# EAGLE design rc (EAGLE 9.6.2)
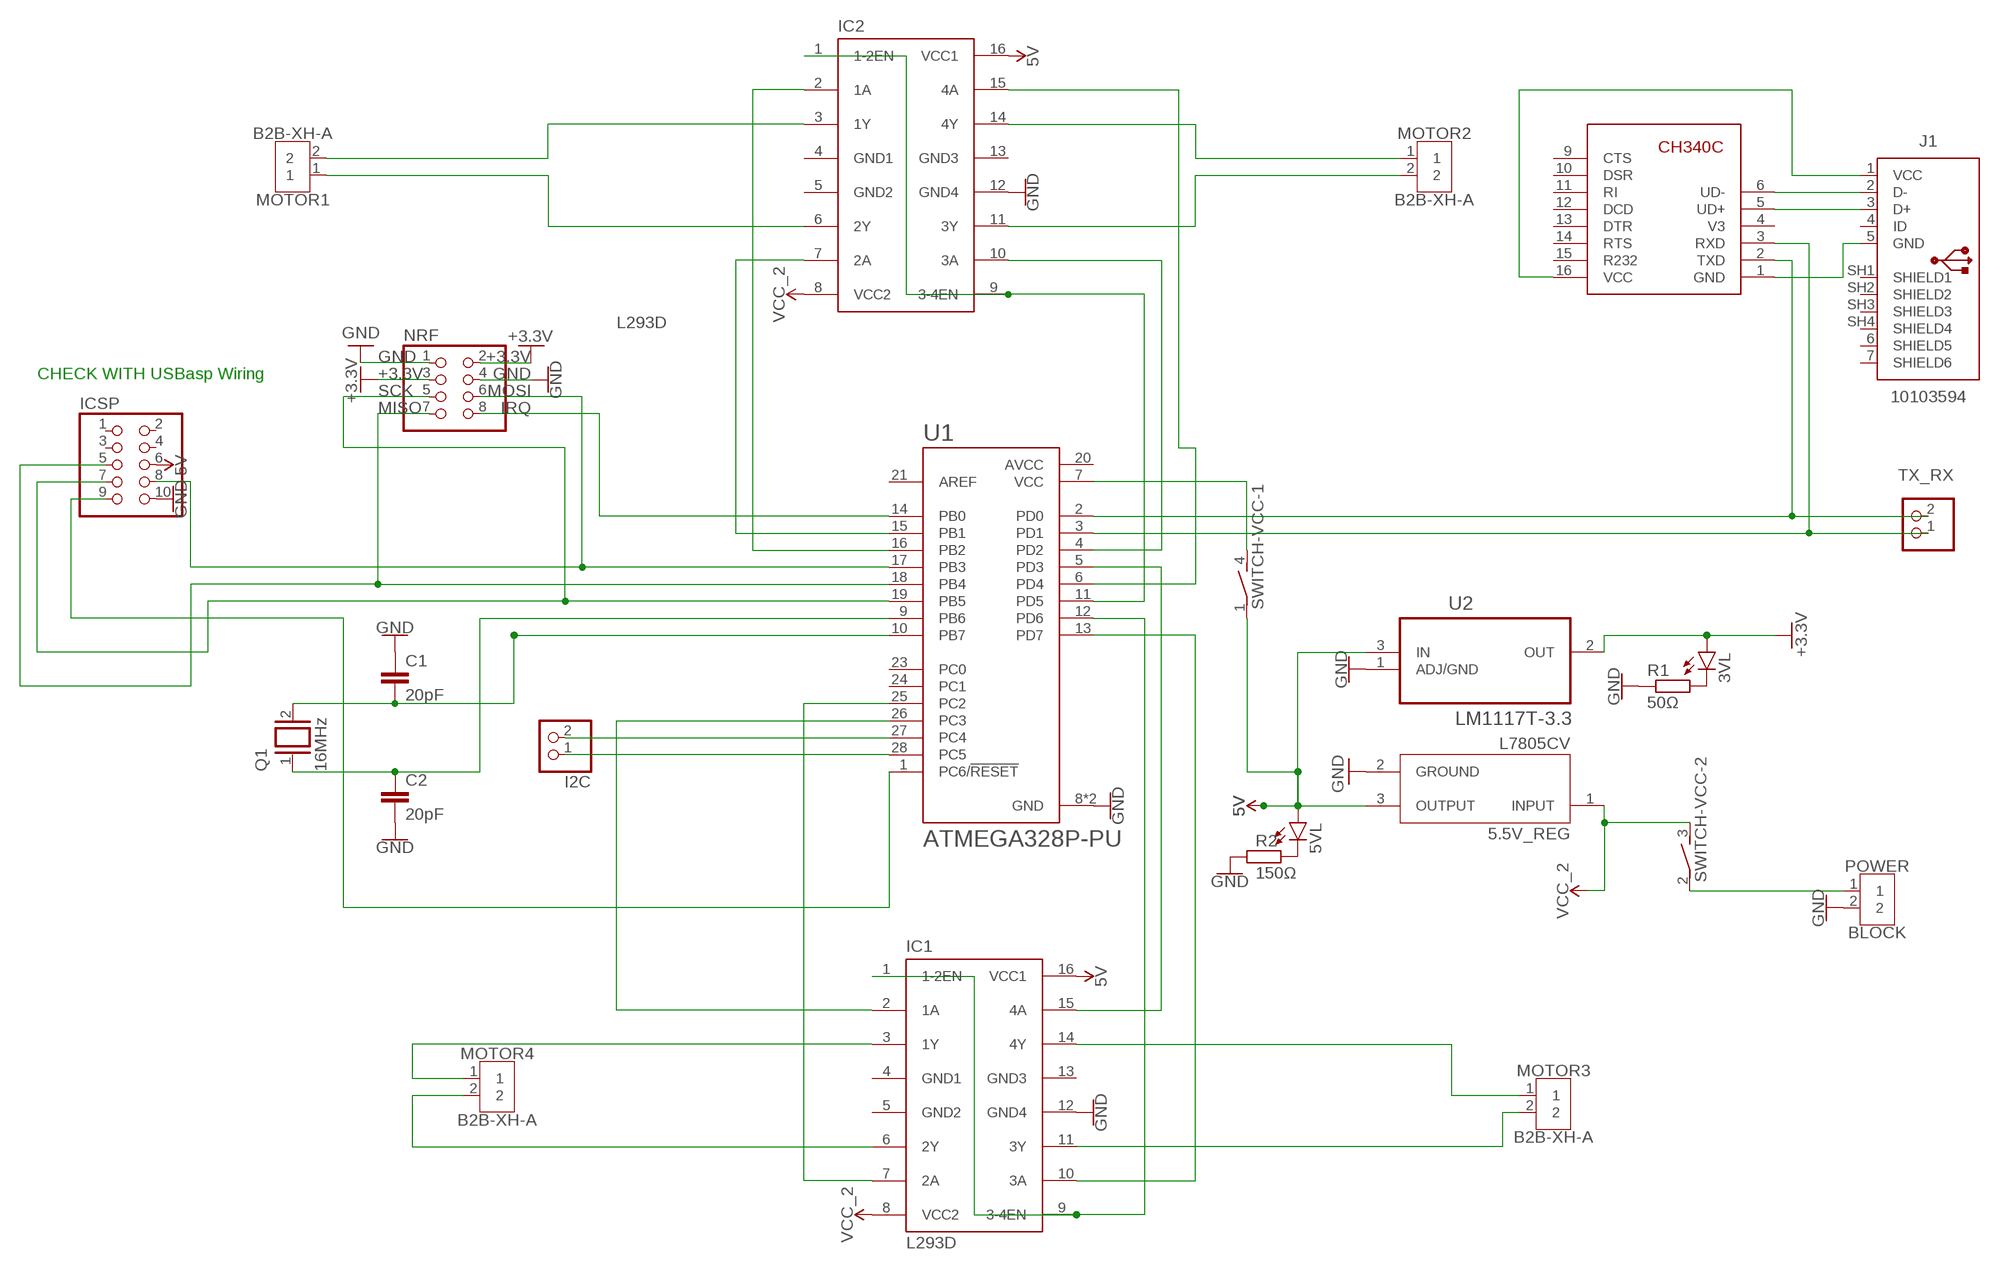
[diagram p0: schematic, sheet 1]

## Parts
3VL  LED5MM  [LED5MM]
5.5V_REG  L7805CV  [TO255P1040X460X1968-3]
5VL  LED5MM  [LED5MM]
C1  20pF  C-EU025-025X050  [C025-025X050]
C2  20pF  C-EU025-025X050  [C025-025X050]
I2C  PINHD-1X2  [1X02]
IC1  L293D  [DIL16]
IC2  L293D  [DIL16]
ICSP  PINHD-2X5  [2X05]
J1  10103594  [10103594]
MOTOR1  B2B-XH-A  [B2B-XH-A]
MOTOR2  B2B-XH-A  [B2B-XH-A]
MOTOR3  B2B-XH-A  [B2B-XH-A]
MOTOR4  B2B-XH-A  [B2B-XH-A]
NRF  PINHD-2X4  [2X04]
POWER  BLOCK  2828XX-2282834-2  [TERMBLK_254-2N]
Q1  16MHz  XTAL/S  [QS]
R1  50Ω  R-EU_0204/7  [0204/7]
R2  150Ω  R-EU_0204/7  [0204/7]
SWITCH-VCC  DS02E  [DS-02]
TX_RX  PINHD-1X2  [1X02]
U1  ATMEGA328P-PU  [DIP794W46P254L2967H457Q28B]
U2  LM1117T-3.3  [TO254P470X1016X2222-3P]
U$1  CH340C  [SOP16-1.27-10.0X5.0MM]

## Nets
5V: 5.5V_REG.3(OUTPUT) 5VL.A IC1.16(VCC1) IC2.16(VCC1) ICSP.6 SWITCH-VCC.1 U2.3(IN)
+3.3V: 3VL.A NRF.2 NRF.3 U2.2(OUT)
GND: 5.5V_REG.2(GROUND) C1.1 C2.2 IC1.12(GND4) IC2.12(GND4) ICSP.10 NRF.1 NRF.4 POWER.2 R1.1 R2.1 U1.8(GND) U1.22(GND) U2.1(ADJ/GND)
IRQ: NRF.8 U1.14(PB0)
MISO: ICSP.5 NRF.7 U1.18(PB4)
MOSI: ICSP.8 NRF.6 U1.17(PB3)
N$1: C1.2 Q1.2 U1.10(PB7)
N$2: J1.1(VCC) U$1.16(VCC)
N$3: IC1.14(4Y) MOTOR3.1
N$4: IC1.11(3Y) MOTOR3.2
N$5: IC1.3(1Y) MOTOR4.1
N$6: IC1.6(2Y) MOTOR4.2
N$7: IC2.3(1Y) MOTOR1.2
N$8: IC2.6(2Y) MOTOR1.1
N$9: IC2.14(4Y) MOTOR2.1
N$10: IC2.11(3Y) MOTOR2.2
N$11: IC2.1(1-2EN) IC2.9(3-4EN) U1.11(PD5)
N$12: IC2.15(4A) U1.6(PD4)
N$13: IC1.1(1-2EN) IC1.9(3-4EN) U1.12(PD6)
N$14: IC2.10(3A) U1.4(PD2)
N$15: IC1.10(3A) U1.13(PD7)
N$16: IC1.2(1A) U1.26(PC3)
N$17: C2.1 Q1.1 U1.9(PB6)
N$19: I2C.2 U1.27(PC4)
N$20: I2C.1 U1.28(PC5)
N$22: 5VL.K(C) R2.2
N$23: 3VL.K(C) R1.2
N$24: J1.2(D-) U$1.6(UD-)
N$26: J1.3(D+) U$1.5(UD+)
N$27: POWER.1 SWITCH-VCC.2
N$28: SWITCH-VCC.4 U1.7(VCC)
N$31: J1.5(GND) U$1.1(GND)
N$32: IC1.15(4A) U1.5(PD3)
N$33: IC1.7(2A) U1.25(PC2)
N$34: IC2.7(2A) U1.15(PB1)
N$35: IC2.2(1A) U1.16(PB2)
RESET: ICSP.9 U1.1(PC6/!RESET)
RX: TX_RX.2 U1.2(PD0) U$1.2(TXD)
SCK: ICSP.7 NRF.5 U1.19(PB5)
TX: TX_RX.1 U1.3(PD1) U$1.3(RXD)
VCC_2: 5.5V_REG.1(INPUT) IC1.8(VCC2) IC2.8(VCC2) SWITCH-VCC.3
Unconnected: ICSP.1 ICSP.2 ICSP.3 ICSP.4 J1.4(ID) J1.6(SHIELD5) J1.7(SHIELD6) J1.SH1(SHIELD1) J1.SH2(SHIELD2) J1.SH3(SHIELD3) J1.SH4(SHIELD4) U1.21(AREF) U1.23(PC0) U1.24(PC1) U$1.4(V3) U$1.9(CTS) U$1.10(DSR) U$1.11(RI) U$1.12(DCD) U$1.13(DTR) U$1.14(RTS) U$1.15(R232)

## Notes on the sheet
- CHECK WITH USBasp Wiring

## Power pins joined to a net without a drawn wire
AVCC: U1.20(AVCC)
GND1: IC1.4(GND1) IC2.4(GND1)
GND2: IC1.5(GND2) IC2.5(GND2)
GND3: IC1.13(GND3) IC2.13(GND3)

## Library data of the parts
3VL 5VL = led:LED: LED OSRAM: - CHIPLED LG R971, LG N971, LY N971, LG Q971, LY Q971, LO R971, LY R971 LH N974, LH R974 LS Q976, LO Q976, LY Q976 LO Q996 - Hyper CHIPLED LW Q18S LB Q993, LB Q99A, LB R99A - SideLED LS A670, LO A670, LY A670, LG A670, LP A670 LB A673, LV A673, LT A673, LW A673 LH A674 LY A675 LS A676, LA A676, LO A676, LY A676, LW A676 LS A679, LY A679, LG A679 - Hyper Micro SIDELED® LS Y876, LA Y876, LO Y876, LY Y876 LT Y87S - SmartLED LW L88C, LW L88S LB L89C, LB L89S, LG L890 LS L89K, LO L89K, LY L89K LS L896, LA L896, LO L896, LY L896 - TOPLED LS T670, LO T670, LY T670, LG T670, LP T670 LSG T670, LSP T670, LSY T670, LOP T670, LYG T670 LG T671, LOG T671, LSG T671 LB T673, LV T673, LT T673, LW T673 LH T674 LS T676, LA T676, LO T676, LY T676, LB T676, LH T676, LSB T676, LW T676 LB T67C, LV T67C, LT T67C, LS T67K, LO T67K, LY T67K, LW E67C LS E67B, LA E67B, LO E67B, LY E67B, LB E67C, LV E67C, LT E67C LW T67C LS T679, LY T679, LG T679 LS T770, LO T770, LY T770, LG T770, LP T770 LB T773, LV T773, LT T773, LW T773 LH T774 LS E675, LA E675, LY E675, LS T675 LS T776, LA T776, LO T776, LY T776, LB T776 LHGB T686 LT T68C, LB T68C - Hyper Mini TOPLED® LB M676 - Mini TOPLED Santana® LG M470 LS M47K, LO M47K, LY M47K Source: http://www.osram.convergy.de LUXEON: - LUMILED® LXK2-PW12-R00, LXK2-PW12-S00, LXK2-PW14-U00, LXK2-PW14-V00 LXK2-PM12-R00, LXK2-PM12-S00, LXK2-PM14-U00 LXK2-PE12-Q00, LXK2-PE12-R00, LXK2-PE12-S00, LXK2-PE14-T00, LXK2-PE14-U00 LXK2-PB12-K00, LXK2-PB12-L00, LXK2-PB12-M00, LXK2-PB14-N00, LXK2-PB14-P00, LXK2-PB14-Q00 LXK2-PR12-L00, LXK2-PR12-M00, LXK2-PR14-Q00, LXK2-PR14-R00 LXK2-PD12-Q00, LXK2-PD12-R00, LXK2-PD12-S00 LXK2-PH12-R00, LXK2-PH12-S00 LXK2-PL12-P00, LXK2-PL12-Q00, LXK2-PL12-R00 Source: www.luxeon.com KINGBRIGHT: KA-3528ASYC Source: www.kingbright.com
5.5V_REG = L7805CV:L7805CV: Standard Regulator Pos 5V 1.5A 3-Pin(3+Tab) TO-220 Standard Regulator Pos 5V 1.5A 3-Pin(3+Tab) TO-220 Check availability <https://pricing.snapeda.com/parts/L7805C-V/STMicroelectronics/view-part?ref=eda>; AVAILABILITY: In Stock; CHECK_PRICES: https://www.snapeda.com/parts/L7805C-V/STMicroelectronics/view-part/?ref=eda; DESCRIPTION: Linear Voltage Regulator IC Positive Fixed 1 Output 1.5A TO-220; MF: STMicroelectronics; MP: L7805C-V; PACKAGE: TO-220-3 STMicroelectronics; PRICE: None; SNAPEDA_LINK: https://www.snapeda.com/parts/L7805C-V/STMicroelectronics/view-part/?ref=snap
C1 C2 = rcl:C-EU: CAPACITOR, European symbol; SPICEPREFIX: C
I2C TX_RX = pinhead:PINHD-1X2: PIN HEADER
IC1 IC2 = st-microelectronics:L293D: PUSH-PULL 4 CHANNEL DRIVER; MPN: L293D; OC_FARNELL: 9589619; OC_NEWARK: 56P8249
ICSP = pinhead:PINHD-2X5: PIN HEADER
J1 = Connector_USB:10103594: USB(2.0) Micro-B, RCPT, 5POS, SMD-THT-R/A Datasheet <https://cdn.amphenol-icc.com/media/wysiwyg/files/documentation/datasheet/inputoutput/io_usb_micro.pdf> Drawing <https://cdn.amphenol-icc.com/media/wysiwyg/files/drawing/10103594.pdf>; CATEGORY: Connectors; CONTACTS: 5; CURRENT-RATING: 1.8A; DESCRIPTION: CONN RCPT USB2.0 MICRO B SMD R/A; GENDER: Receptacle; MANUFACTURER: Amphenol ICC (FCI); MOUNT_TYPE: R/A; MPN: 10103594-0001LF; OPERATING_TEMPERATURE: -30°C ~ 80°C; PART_STATUS: ACTIVE; ROHS_COMPLIANT: COMPLIANT; SUB_CATEGORY: USB; TYPE: USB-micro B; VOLTAGE-RATING: 100VAC
MOTOR1-MOTOR4 = Connector:B2B-XH-A: XH Connector Top Entry - 2POS Details see: Datasheet <http://www.jst-mfg.com/product/pdf/eng/eXH.pdf>; CATEGORY: Header; DESCRIPTION: Connector Header Through Hole 2 position 0.098" (2.50mm); MANUFACTURER: JST Sales America Inc.; MPN: B2B-XH-A(LF)(SN); OPERATING_TEMPERATURE: -25°C ~ 85°C; PART_STATUS: ACTIVE; PITCH: 0.098" (2.50mm); ROHS_COMPLIANCE: ROHS3 Compliant; SERIES: XH; SUB_CATEGORY: Rectangular Connectors; TYPE: Header, Male Pin, Board to Cable/Wire, Through Hole
NRF = pinhead:PINHD-2X4: PIN HEADER
POWER = Connector:2828XX-2: 2 Position Wire to Board Terminal Block Horizontal with Board Datasheet <https://www.te.com.cn/commerce/DocumentDelivery/DDEController?Action=showdoc&DocId=Catalog+Section%7F1308389_EUROSTYLE_TERMINAL_BLOCKS%7F0607%7Fpdf%7FEnglish%7FENG_CS_1308389_EUROSTYLE_TERMINAL_BLOCKS_0607.pdf%7F2-282837-5>; CATEGORY: Fixed Terminal Blocks; DESCRIPTION: Fixed Terminal Blocks 2P SIDE ENTRY 2.54mm; MANUFACTURER: TE Connectivity AMP Connectors; MPN: 282834-2; OPERATING_TEMPERATURE: -40°C ~ 105°C; PART_STATUS: Active; PITCH: 0.100" (2.54mm); ROHS_COMPLIANCE: RoHS Compliant; SERIES: Buchanan; SUBCATEGORY: Terminal Blocks; TYPE: Through Hole; Screw - Rising Cage Clamp; Side wire entry, Horizontal with Board
Q1 = special:XTAL/S: CRYSTAL
R1 R2 = rcl:R-EU_: RESISTOR, European symbol; SPICEPREFIX: R
SWITCH-VCC = Switch:DS02E: DIL/CODE SWITCH; CATEGORY: SWITCH; TYPE: SPST
U1 = ATMEGA328P-PU:ATMEGA328P-PU: ATmega Series 20 MHz 32 KB Flash 2 KB SRAM 8-Bit Microcontroller - DIP-28 Check availability <https://pricing.snapeda.com/parts/ATMEGA328P-PU/Microchip/view-part?ref=eda>; AVAILABILITY: In Stock; CHECK_PRICES: https://www.snapeda.com/parts/ATMEGA328P-PU/Microchip/view-part/?ref=eda; DESCRIPTION: MCU 8-bit - AVR ATmega Family ATmega328 Series Microcontrollers - 20 MHz - 32 KB - 2 KB - 28 Pins.; MF: Microchip; MP: ATMEGA328P-PU; PACKAGE: PDIP-28 Atmel; PRICE: None; SNAPEDA_LINK: https://www.snapeda.com/parts/ATMEGA328P-PU/Microchip/view-part/?ref=snap
U2 = LM1117T-3.3:LM1117T-3.3: IC, LDO VOLT REG, 3.3V, 0.8A Check availability <https://pricing.snapeda.com/parts/LM1117T-3.3/Texas%20Instruments/view-part?ref=eda>; AVAILABILITY: In Stock; CHECK_PRICES: https://www.snapeda.com/parts/LM1117T-3.3/Texas+Instruments/view-part/?ref=eda; DESCRIPTION: Linear Voltage Regulator IC Positive Fixed 1 Output 800mA TO-220-3; MF: Texas Instruments; MP: LM1117T-3.3; PACKAGE: TO-220-3 TEXAS INSTRUMENTS; PRICE: None; SNAPEDA_LINK: https://www.snapeda.com/parts/LM1117T-3.3/Texas+Instruments/view-part/?ref=snap
U$1 = CH340C:CH340C: CH340C crystalless usb serial driver Check availability <https://pricing.snapeda.com/parts/CH340C/Olimex/view-part?ref=eda>; AVAILABILITY: Not in stock; CHECK_PRICES: https://www.snapeda.com/parts/CH340C/Olimex/view-part/?ref=eda; DESCRIPTION: Replacement for Brother P-Touch; MF: Olimex; MP: CH340C; PACKAGE: None; PRICE: None; SNAPEDA_LINK: https://www.snapeda.com/parts/CH340C/Olimex/view-part/?ref=snap

## Board
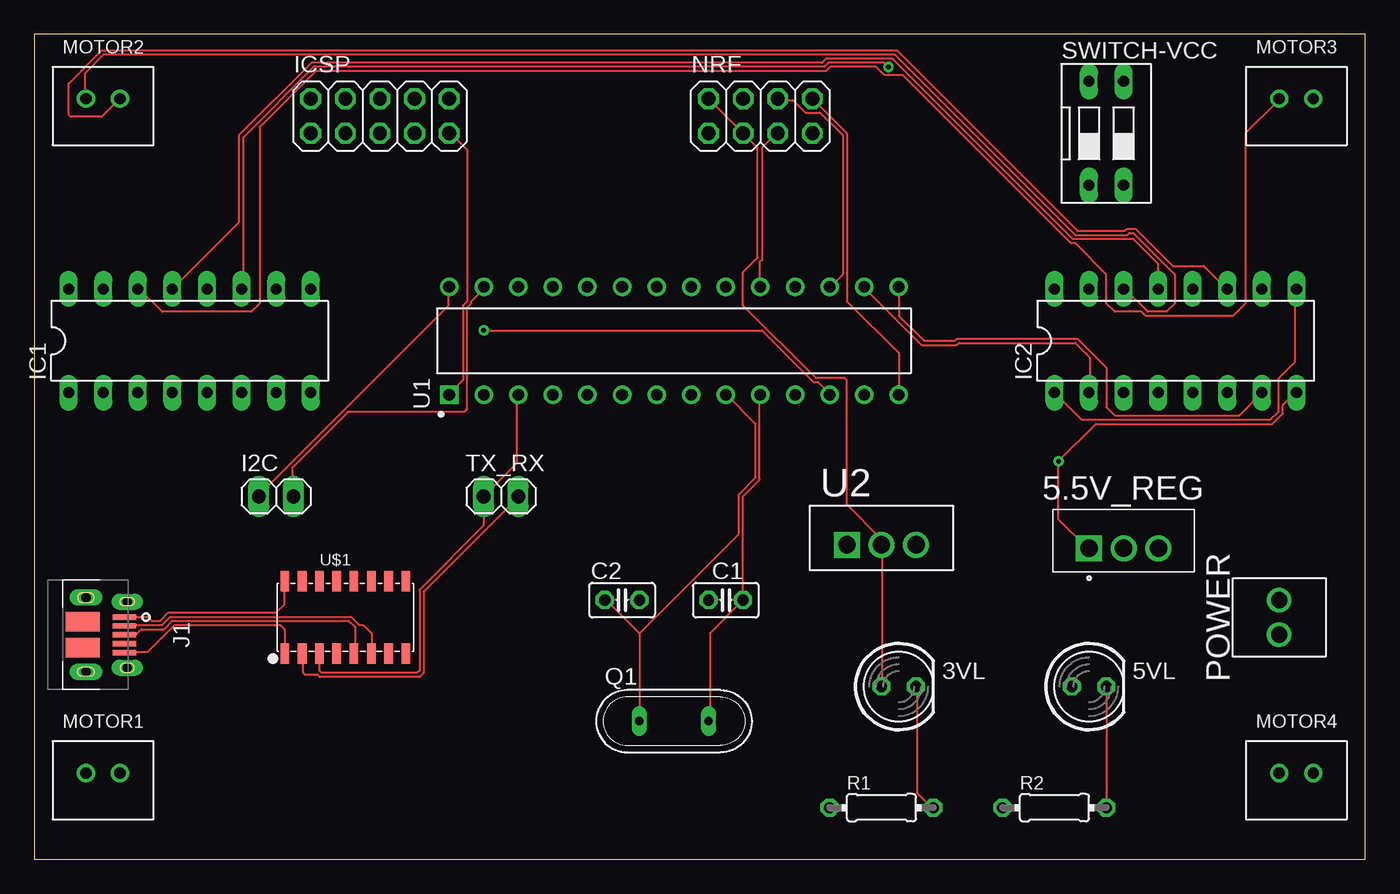
[diagram p1: board, top side]
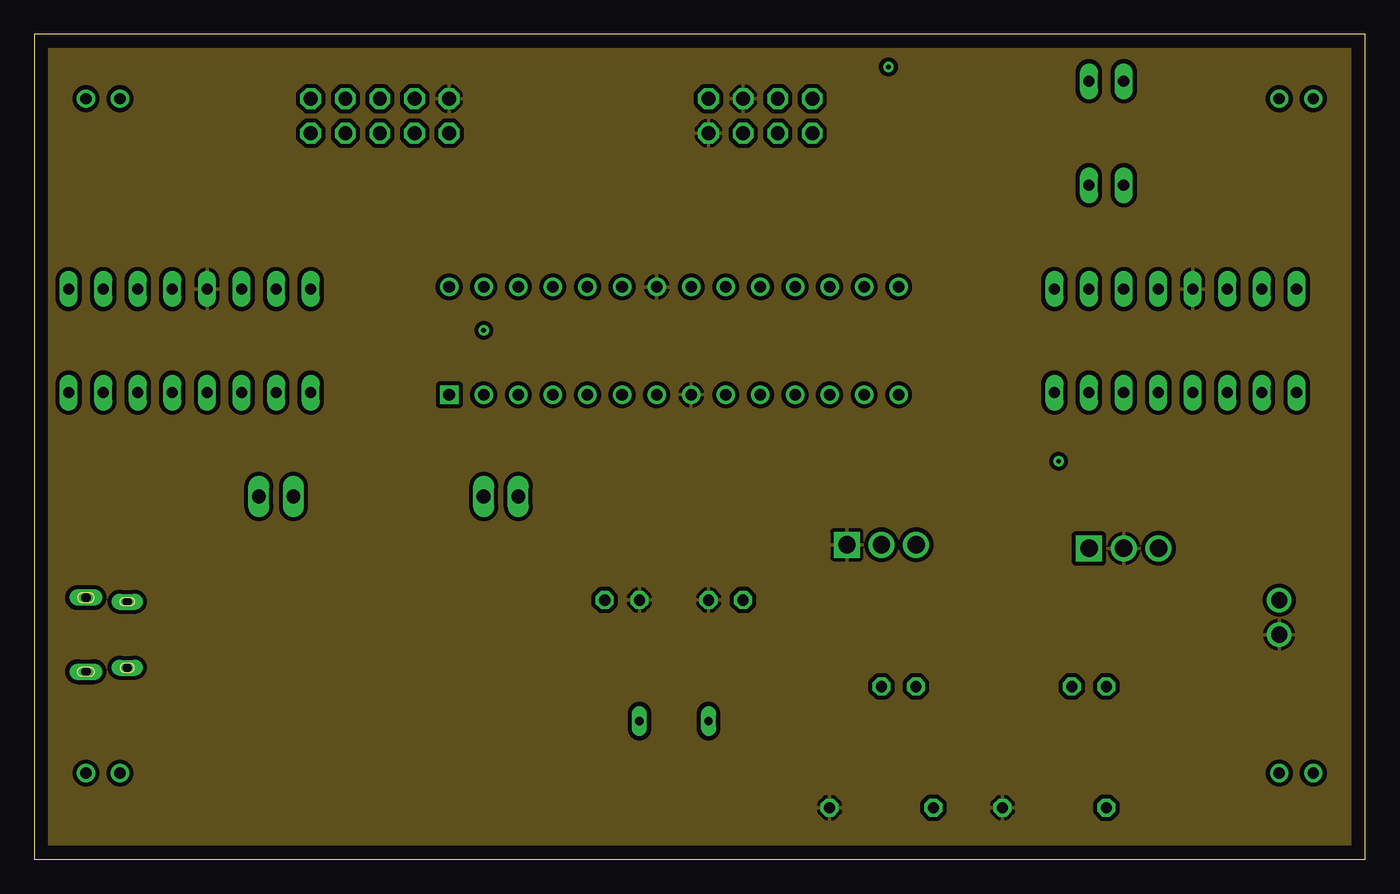
[diagram p2: board, inner layer GND_LAYER]
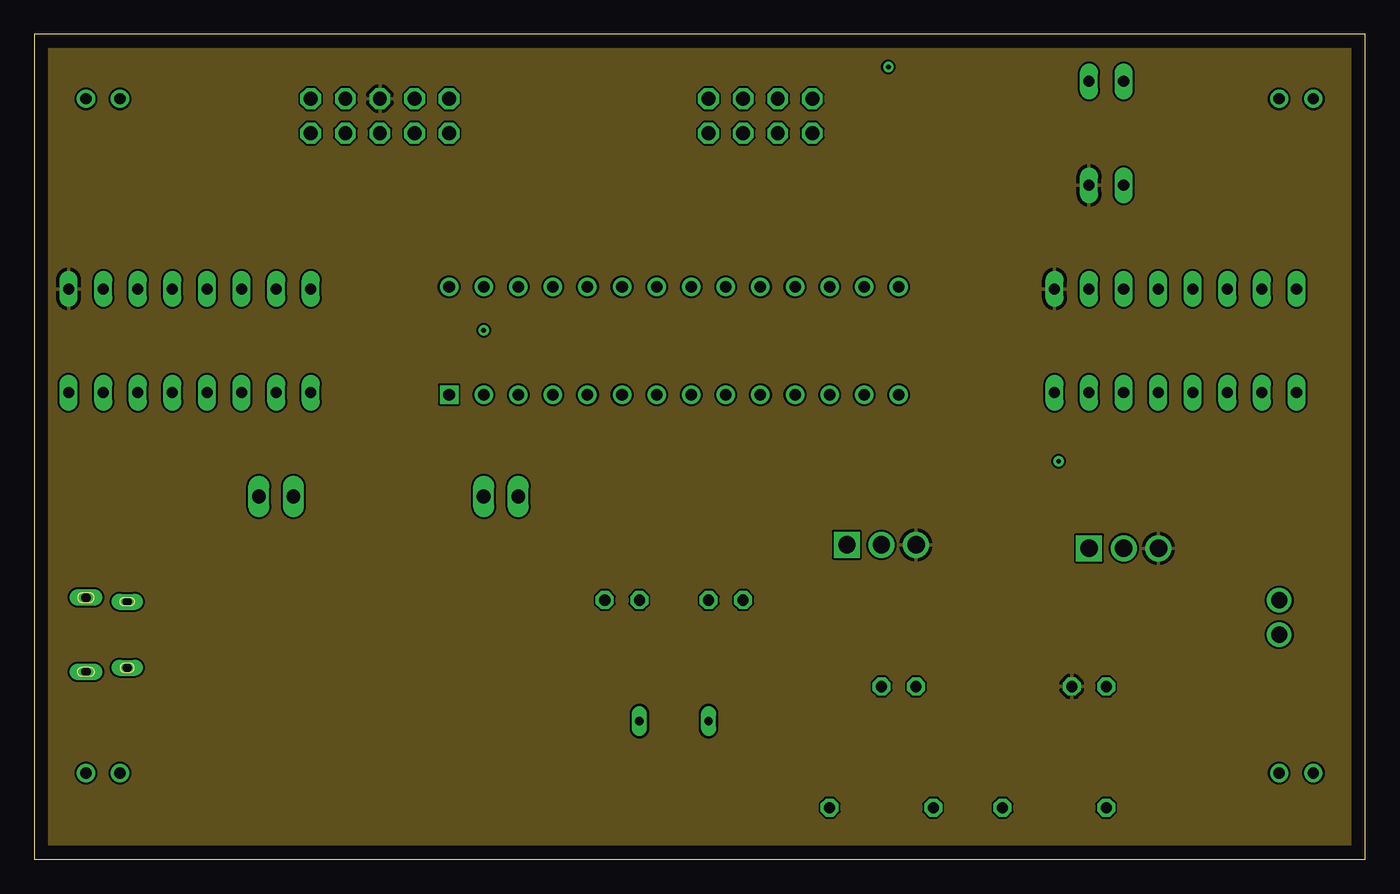
[diagram p3: board, inner layer POWER_LAYER]
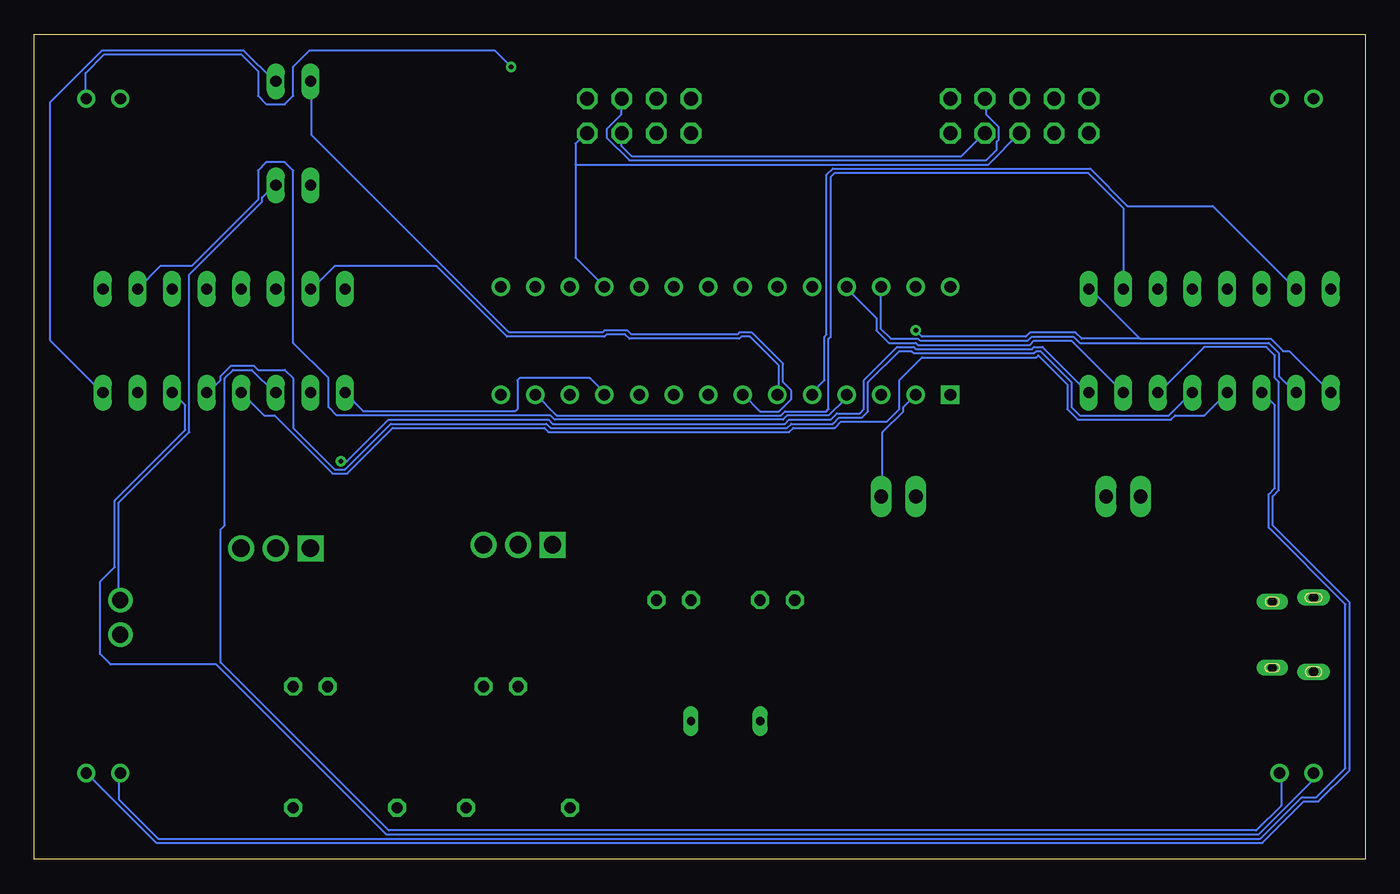
[diagram p4: board, bottom side, seen from below]

Size 97.77 x 60.63 mm. Coordinates in mm from the lower left corner, seen from the top.
Outline: 0,0 97.77,0 97.77,60.63 0,60.63 0,0
Copper layers ([2:1+(2*15)+16:15]): Top 0.035mm / dielectric 1.5mm / GND_LAYER 0.035mm / dielectric 0.15mm / POWER_LAYER 0.035mm / dielectric 0.2mm / Bottom 0.035mm
Design rules "default *": minimum track width 6mil, minimum drill 0.35mm, track to track 6mil, track to pad 6mil, pad to pad 6mil, via to via 6mil, smd to smd 6mil, copper to edge 40mil, drill to drill 6mil, minimum pad ring 10mil, minimum via ring 8mil, stop-mask expansion 4mil, vias tented up to drill 0mil, thermal gap 10mil

### Footprints (pad centres in the part's own frame; a part is rotated, then mirrored left to right if it is on the bottom)
LED5MM = drill 0.813 octagon: A -1.27,0; K 1.27,0
TO255P1040X460X1968-3 = drill 1.27 pad 1.91 square: 1 0,0 | drill 1.27 pad 1.91: 2 2.55,0; 3 5.1,0
C025-025X050 = drill 0.813 octagon: 1 -1.27,0; 2 1.27,0
1X02 = drill 1.016 long: 1 -1.27,0; 2 1.27,0
DIL16 = drill 0.813 long: 1 -8.89,-3.81; 2 -6.35,-3.81; 3 -3.81,-3.81; 4 -1.27,-3.81; 5 1.27,-3.81; 6 3.81,-3.81; 7 6.35,-3.81; 8 8.89,-3.81; 9 8.89,3.81; 10 6.35,3.81; 11 3.81,3.81; 12 1.27,3.81; 13 -1.27,3.81; 14 -3.81,3.81; 15 -6.35,3.81; 16 -8.89,3.81
2X05 = drill 1.016 octagon: 1 -5.08,-1.27; 2 -5.08,1.27; 3 -2.54,-1.27; 4 -2.54,1.27; 5 0,-1.27; 6 0,1.27; 7 2.54,-1.27; 8 2.54,1.27; 9 5.08,-1.27; 10 5.08,1.27
10103594 = smd 0.4 x 1.75: 1 -1.3,2.825; 2 -0.65,2.825; 3 0,2.825; 4 0.65,2.825; 5 1.3,2.825 | smd 1.425 x 2.5: 6 -0.963,-0.25; 7 0.963,-0.25 | drill 0.65 pad 0.73 long: SH1 -2.425,3.03; SH2 2.425,3.03 | drill 0.7 long: SH3 -2.725,0; SH4 2.725,0
B2B-XH-A = drill 0.84: 1 0,0; 2 2.5,0
2X04 = drill 1.016 octagon: 1 -3.81,-1.27; 2 -3.81,1.27; 3 -1.27,-1.27; 4 -1.27,1.27; 5 1.27,-1.27; 6 1.27,1.27; 7 3.81,-1.27; 8 3.81,1.27
TERMBLK_254-2N = drill 1.2: 1 0,0; 2 2.54,0
QS = drill 0.61 long: 1 -2.54,0; 2 2.54,0
0204/7 = drill 0.813 octagon: 1 -3.81,0; 2 3.81,0
DS-02 = drill 0.813 long: 1 -1.27,-3.81; 2 1.27,-3.81; 3 1.27,3.81; 4 -1.27,3.81
DIP794W46P254L2967H457Q28B = drill 0.85 square: 1 -3.96,16.51 | drill 0.85: 2 -3.96,13.97; 3 -3.96,11.43; 4 -3.96,8.89; 5 -3.96,6.35; 6 -3.96,3.81; 7 -3.96,1.27; 8 -3.96,-1.27; 9 -3.96,-3.81; 10 -3.96,-6.35; 11 -3.96,-8.89; 12 -3.96,-11.43; 13 -3.96,-13.97; 14 -3.96,-16.51; 15 3.96,-16.51; 16 3.96,-13.97; 17 3.96,-11.43; 18 3.96,-8.89; 19 3.96,-6.35; 20 3.96,-3.81; 21 3.96,-1.27; 22 3.96,1.27; 23 3.96,3.81; 24 3.96,6.35; 25 3.96,8.89; 26 3.96,11.43; 27 3.96,13.97; 28 3.96,16.51
TO254P470X1016X2222-3P = drill 1.27 square: 1 -5.08,-1.016 | drill 1.27: 2 -2.54,-1.016; 3 0,-1.016
SOP16-1.27-10.0X5.0MM = smd 0.635 x 1.524: 1 -4.445,-2.667; 2 -3.175,-2.667; 3 -1.905,-2.667; 4 -0.635,-2.667; 5 0.635,-2.667; 6 1.905,-2.667; 7 3.175,-2.667; 8 4.445,-2.667; 9 4.445,2.667; 10 3.175,2.667; 11 1.905,2.667; 12 0.635,2.667; 13 -0.635,2.667; 14 -1.905,2.667; 15 -3.175,2.667; 16 -4.445,2.667

### Placement (x,y rotation side)
3VL  63.5,12.7 0 top
5.5V_REG  77.47,22.86 0 top
5VL  77.47,12.7 0 top
C1  50.8,19.05 0 top
C2  43.18,19.05 0 top
I2C  17.78,26.67 0 top
IC1  11.43,38.1 0 top
IC2  83.82,38.1 0 top
ICSP  25.4,54.61 0 top
J1  3.81,16.51 270 top
MOTOR1  3.81,6.35 0 top
MOTOR2  3.81,55.88 0 top
MOTOR3  91.44,55.88 0 top
MOTOR4  91.44,6.35 0 top
NRF  53.34,54.61 0 top
POWER  91.44,19.05 270 top
Q1  46.99,10.16 0 top
R1  62.23,3.81 0 top
R2  74.93,3.81 0 top
SWITCH-VCC  78.74,53.34 0 top
TX_RX  34.29,26.67 0 top
U1  46.99,38.1 90 top
U2  64.77,24.13 0 top
U$1  22.86,17.78 0 top

### Tracks (layer width: path | path; a pad name or v marks a point on that pad's centre or on a via)
5V
  pour POWER_LAYER: 0,57.15 0,60.96 97.79,60.96 97.79,0 0,0
+3.3V
  Top 0.152: NRF.2 NRF.3 53.14,52.27 53.14,44.2 52.07,43.13 52.07,40.69 57.4,35.36 59.54,35.36 59.69,35.2 59.69,26.06 62.13,23.62 62.13,23.16 U2.2 62.28,23.01 62.28,12.8 3VL.A
GND
  pour GND_LAYER (isolate 0.305): 0,60.96 97.79,60.96 97.79,0 0,0
GND1
  Bottom 0.152: IC1.4 11.84,32.61 13.97,32.61 14.28,32.31 21.13,32.31 21.89,33.07 21.89,34.9 24.03,37.03 24.18,36.88 32.56,36.88 34.24,35.2 34.24,33.07 35.15,32.16 38.51,32.16 38.96,31.7 42.01,31.7 42.32,31.39 60,31.39 60.3,31.7 71.42,31.7 74.78,28.35 75.84,28.35 80.11,32.61 80.87,32.61 IC2.4
GND2
  Bottom 0.152: IC1.5 12.75,34.29 14.43,32.61 20.98,32.61 21.59,33.22 21.59,35.05 23.88,37.34 24.18,37.34 24.33,37.19 33.17,37.19 33.33,37.34 34.24,37.34 36.53,35.05 36.53,32.92 36.98,32.46 38.66,32.46 39.12,32 42.16,32 42.47,31.7 59.84,31.7 60.15,32 71.58,32 74.93,28.65 75.69,28.65 78.74,31.7 78.74,35.36 79.35,35.97 81.33,35.97 81.64,36.27 83.31,36.27 84.07,35.51 84.07,35.2 84.99,34.29 IC2.5
GND3
  Top 0.152: IC1.13 15.04,46.79 15.04,53.19 20.37,58.52 57.86,58.52 58.17,58.83 63.04,58.83 76.3,45.57 80.72,45.57 82.55,43.74 IC2.13
IRQ
  Top 0.152: U1.14 63.5,37.19 59.69,41 59.69,53.34 NRF.8
MISO
  Bottom 0.152: 58.01,51.05 58.01,52.58 57.25,53.34 NRF.7 | 58.01,51.05 58.01,44.2 U1.18 | ICSP.5 27.69,51.05 58.01,51.05
MOSI
  Top 0.152: U1.17 58.47,42.06 59.39,42.98 59.39,53.19 57.71,54.86 56.64,54.86 55.73,55.78 54.66,55.78 NRF.6
  Bottom 0.152: ICSP.8 27.84,55.78 27.84,54.71 26.92,53.8 26.92,52.88 27.08,52.73 27.08,52.12 27.84,51.36 54.05,51.36 55.73,53.04 55.73,53.65 54.66,54.71 54.66,55.78 NRF.6
N$1
  Top 0.152: Q1.2 49.63,10.21 49.63,16.61 C1.2 52.07,26.67 53.29,27.89 53.29,34.14 U1.10
N$2
  Top 0.152: U$1.16 18.39,20.42 18.39,18.74 17.78,18.14 9.86,18.14 9.25,17.53 8.64,17.53 8.33,17.83 6.65,17.83 J1.1
N$3
  Top 0.152: IC1.14 7.72,41.91 9.4,40.23 15.95,40.23 16.56,40.84 16.56,53.8 20.68,57.91 58.17,57.91 58.47,58.22 61.82,58.22 62.43,57.61 63.81,57.61 76.15,45.26 76.45,45.26 78.74,42.98 78.74,40.84 79.35,40.23 81.33,40.23 81.64,39.93 88.04,39.93 88.95,40.84 88.95,53.34 91.39,55.78 MOTOR3.1
N$4  (via drill 0.35)
  Top 0.152: v62.74,58.22 62.43,58.52 58.32,58.52 58.01,58.22 20.52,58.22 15.34,53.04 15.34,41.91 IC1.11
  Bottom 0.152: v62.74,58.22 63.96,59.44 77.52,59.44 78.74,58.22 78.74,56.08 79.35,55.47 80.72,55.47 81.33,56.08 81.33,57.91 82.55,59.13 92.61,59.13 93.98,57.76 93.98,55.93 MOTOR3.2
N$5
  Bottom 0.152: IC1.3 7.57,34.29 6.65,33.38 6.65,27.28 7.11,26.82 7.11,24.38 1.47,18.74 1.47,6.71 3.61,4.57 4.67,4.57 7.72,1.52 88.65,1.52 91.54,4.42 91.54,6.25 MOTOR4.1
N$6
  Bottom 0.152: IC1.6 15.19,34.29 11.84,37.64 7.26,37.64 6.65,37.03 6.65,35.36 6.35,35.05 6.35,27.13 6.81,26.67 6.81,24.54 1.17,18.9 1.17,6.55 3.45,4.27 4.52,4.27 7.57,1.22 88.8,1.22 93.83,6.25 MOTOR4.2
N$7
  Bottom 0.152: IC2.3 80.11,34.29 81.79,35.97 83.16,35.97 83.77,35.36 83.77,24.54 84.07,24.23 84.07,14.48 71.73,2.13 8.03,2.13 6.2,3.96 6.2,6.25 MOTOR1.2
N$8
  Bottom 0.152: IC2.6 87.58,34.29 86.67,33.38 86.67,31.55 91.85,26.36 91.85,21.49 92.91,20.42 92.91,15.09 92.15,14.33 84.38,14.33 71.88,1.83 7.87,1.83 3.91,5.79 3.91,6.25 MOTOR1.1
N$9
  Top 0.152: IC2.14 80.11,41.91 81.79,40.23 83.16,40.23 83.77,40.84 83.77,42.98 80.72,46.03 80.42,46.03 80.26,45.87 76.45,45.87 63.2,59.13 5.13,59.13 3.76,57.76 3.76,55.93 MOTOR2.1
N$10
  Top 0.152: IC2.11 87.58,41.91 85.9,43.59 83.62,43.59 80.87,46.33 80.26,46.33 80.11,46.18 76.61,46.18 63.35,59.44 4.98,59.44 2.54,57 2.54,54.71 2.69,54.56 4.98,54.56 6.2,55.78 MOTOR2.2
N$11
  Top 0.152: IC2.1 76.91,32.31 90.78,32.31 91.39,32.92 91.39,35.36 92.61,36.58 92.61,41.91 IC2.9
  Bottom 0.152: IC2.1 73.56,32.92 62.43,32.92 62.28,33.07 62.28,35.2 62.13,35.36 56.95,35.36 55.88,34.29 U1.11
N$12
  Bottom 0.152: IC2.15 77.37,41.91 75.69,43.59 68.22,43.59 63.04,38.41 55.88,38.41 55.73,38.56 54.36,38.56 54.05,38.25 45.97,38.25 45.82,38.41 45.21,38.41 43.08,36.27 43.08,34.29 U1.6
N$13  (via drill 0.35)
  Top 0.152: v33.02,38.86 53.44,38.86 57.25,35.05 57.56,35.05 58.32,34.29 U1.12
  Bottom 0.152: IC1.1 5.59,37.34 6.04,37.34 6.96,38.25 16.56,38.25 | 16.56,38.25 20.22,41.91 IC1.9 | v33.02,38.86 32.56,38.41 24.94,38.41 24.64,38.71 21.29,38.71 20.83,38.25 16.56,38.25
N$14
  Bottom 0.152: IC2.10 88.49,43.59 86.21,43.59 81.33,48.46 81.33,50.6 80.72,51.21 79.35,51.21 78.74,50.6 78.74,37.95 76.15,35.36 76.15,33.22 75.54,32.61 59.84,32.61 59.54,32.31 42.77,32.31 42.47,32.61 39.42,32.61 38.2,33.83 38.2,34.14 U1.4
N$15
  Bottom 0.152: IC1.10 17.78,47.85 20.37,50.44 38.96,50.44 39.27,50.14 39.27,38.41 39.42,38.25 39.42,33.07 39.57,32.92 42.62,32.92 42.93,32.61 59.39,32.61 60.91,34.14 U1.13
N$16
  Bottom 0.152: IC1.2 5.13,34.29 6.35,35.51 6.35,37.19 7.11,37.95 20.98,37.95 21.44,38.41 24.49,38.41 24.79,38.1 32.72,38.1 32.87,38.25 34.85,38.25 35.61,39.01 35.61,41.91 U1.26
N$17
  Top 0.152: 44.45,16.61 Q1.1 | 44.45,16.61 42.01,19.05 C2.1 | 44.45,16.61 51.77,23.93 51.77,26.82 52.98,28.04 52.98,32 50.85,34.14 U1.9
N$19
  Top 0.152: U1.27 33.02,41.91 32.11,41 32.11,40.84 31.8,40.54 31.8,33.07 31.65,32.92 23.11,32.92 19,28.8 19,26.67 I2C.2
N$20
  Top 0.152: U1.28 30.43,41.91 30.43,40.69 16.41,26.67 I2C.1
N$22
  Top 0.152: 5VL.K R2.2
N$23
  Top 0.152: 3VL.K 64.87,12.65 64.87,4.88 65.94,3.81 R1.2
N$24
  Top 0.152: U$1.6 24.79,15.24 24.79,16.61 24.18,17.22 23.88,17.22 23.27,17.83 10.01,17.83 9.4,17.22 6.65,17.22 J1.2
N$26
  Top 0.152: U$1.5 23.57,15.24 23.57,17.07 23.11,17.53 10.16,17.53 9.55,16.92 7.87,16.92 7.42,16.46 6.65,16.46 J1.3
N$27
  Bottom 0.152: SWITCH-VCC.2 80.11,49.53 81.03,48.62 81.03,48.31 86.36,42.98 86.36,31.39 91.54,26.21 91.54,19.05 POWER.1
N$28
  Bottom 0.152: SWITCH-VCC.4 77.37,57.15 77.37,53.19 62.89,38.71 56.03,38.71 55.88,38.86 54.2,38.86 53.9,38.56 46.13,38.56 45.97,38.71 45.06,38.71 42.77,36.42 42.77,35.05 42.16,34.44 42.16,33.83 43.08,32.92 44.45,32.92 45.67,34.14 U1.7
N$31
  Top 0.152: U$1.1 18.39,15.24 18.39,16.92 18.08,17.22 10.31,17.22 8.33,15.24 6.65,15.24 J1.5
N$32
  Bottom 0.152: IC1.15 5.13,41.91 11.23,48.01 17.47,48.01 20.22,50.75 39.12,50.75 39.57,50.29 39.57,38.56 39.73,38.41 39.73,35.2 40.64,34.29 U1.5
N$33
  Bottom 0.152: IC1.7 21.59,38.1 24.33,38.1 24.64,37.8 32.87,37.8 33.02,37.95 35,37.95 35.92,38.86 35.92,39.78 38.05,41.91 U1.25
N$34
  Top 0.152: IC2.7 88.49,32.61 79.35,32.61 78.74,33.22 78.74,36.12 76.61,38.25 67.77,38.25 67.62,38.1 65.33,38.1 63.5,39.93 U1.15
N$35
  Top 0.152: IC2.2 77.52,34.29 77.52,36.88 76.45,37.95 67.92,37.95 67.77,37.8 65.18,37.8 61.06,41.91 U1.16
RESET
  Top 0.152: U1.1 30.58,34.29 31.5,35.2 31.5,40.69 31.8,41 31.8,52.12 30.58,53.34 ICSP.9
RX
  Top 0.152: U$1.2 19.76,15.09 19.76,13.72 19.91,13.56 20.83,13.56 20.98,13.41 28.3,13.41 28.6,13.72 28.6,19.66 35.61,26.67 TX_RX.2
  Bottom 0.152: U1.2 33.93,33.22 33.93,32.92 35.46,31.39 35.46,26.67 TX_RX.2
SCK
  Top 0.152: U1.19 53.29,42.06 53.29,43.89 53.44,44.04 53.44,52.27 54.51,53.34 NRF.5
  Bottom 0.152: ICSP.7 27.99,53.34 29.67,51.66 53.9,51.66 54.66,52.43 54.66,53.34 NRF.5
TX
  Top 0.152: U$1.3 20.98,15.09 20.98,13.87 21.13,13.72 28.14,13.72 28.3,13.87 28.3,19.81 33.02,24.54 TX_RX.1 35.46,29.11 35.46,34.14 U1.3
VCC_2  (via drill 0.35)
  Top 0.152: 5.5V_REG.1 77.37,22.86 75.23,24.99 v75.23,29.26 77.98,32 90.93,32 91.69,32.77 91.69,33.38 92.61,34.29 IC2.8
  Bottom 0.152: v75.23,29.26 74.78,29.26 71.73,32.31 60,32.31 59.69,32 42.62,32 42.32,32.31 39.27,32.31 38.81,32.77 37.14,32.77 36.83,33.07 36.83,35.2 34.39,37.64 33.17,37.64 33.02,37.49 24.49,37.49 24.33,37.64 23.72,37.64 20.37,34.29 IC1.8 | SWITCH-VCC.3 80.11,57.15 82.4,59.44 92.76,59.44 96.57,55.63 96.57,38.1 92.76,34.29 IC2.8